# EAGLE design RoboTurkey (EAGLE 5.11)
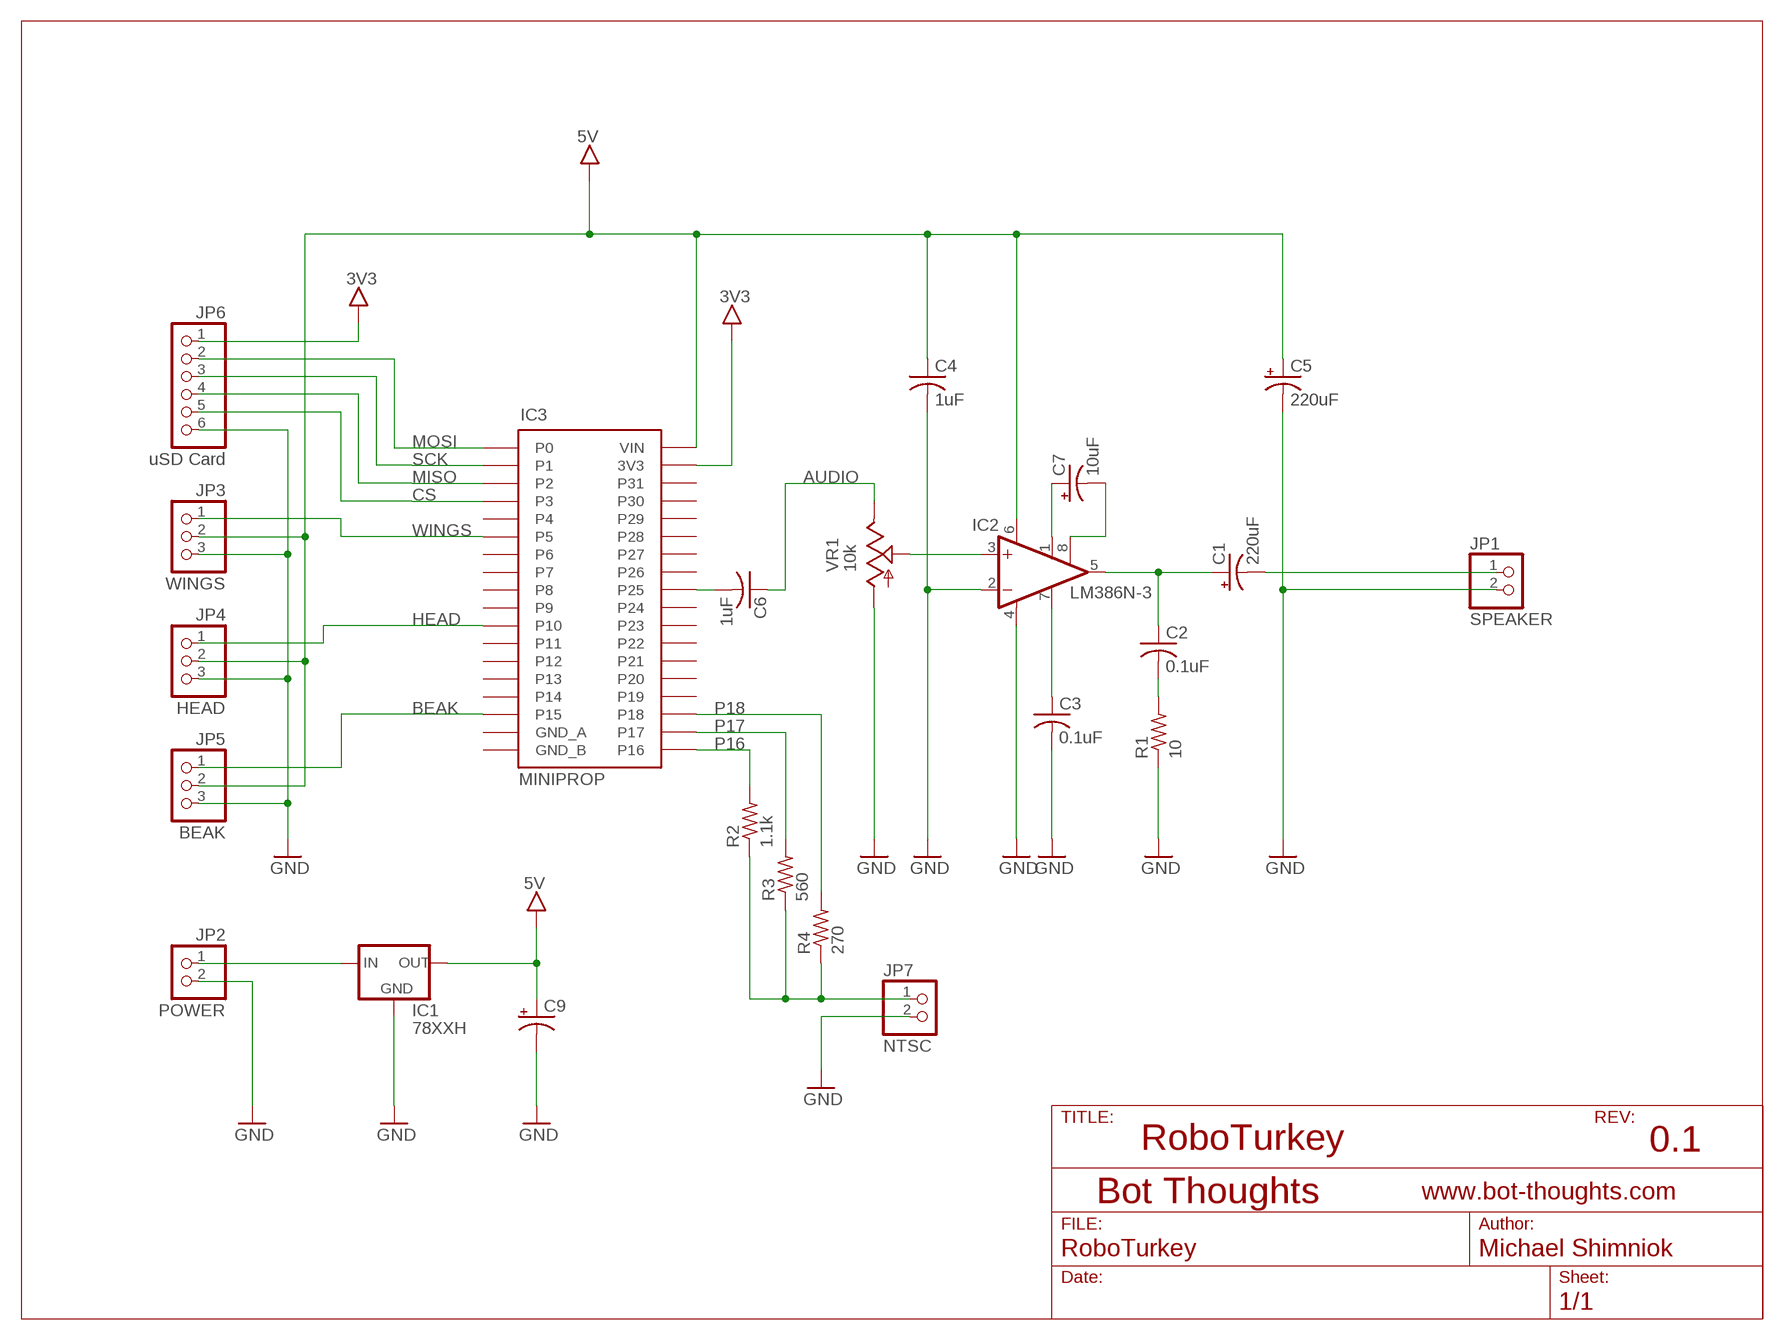
[diagram p0: schematic, sheet 1]

## Parts
C1  220uF  CPOL-USE2.5-6  [E2,5-6]
C2  0.1uF  C-US050-025X075  [C050-025X075]
C3  0.1uF  C-US050-025X075  [C050-025X075]
C4  1uF  C-US050-025X075  [C050-025X075]
C5  220uF  CPOL-USE2.5-6  [E2,5-6]
C6  1uF  C-US050-025X075  [C050-025X075]
C7  10uF  CPOL-USE2.5-6  [E2,5-6]
C9  CPOL-USE5-10.5  [E5-10,5]
IC1  78XXH  [TO220BH]
IC2  LM386N-3  [DIL08]
IC3  MINIPROP  [MINIPROP]
JP1  SPEAKER  PINHD-1X02_2.54-S  [1X02-S]
JP2  POWER  PINHD-1X02_2.54-S  [1X02-S]
JP3  WINGS  PINHD-1X03_2.54-S  [1X03-S]
JP4  HEAD  PINHD-1X03_2.54-S  [1X03-S]
JP5  BEAK  PINHD-1X03_2.54-S  [1X03-S]
JP6  uSD Card  PINHD-1X06_2.54-S  [1X06-S]
JP7  NTSC  PINHD-1X02_2.54-S  [1X02-S]
R1  10  R-US_0207/10  [0207/10]
R2  1.1k  R-US_0207/10  [0207/10]
R3  560  R-US_0207/10  [0207/10]
R4  270  R-US_0207/10  [0207/10]
VR1  10k  TRIM_US-CA6V  [CA6V]

## Nets
3V3: IC3.P$35(3V3) JP6.1
AUDIO: C6.1 VR1.E
BEAK: IC3.P$16(P15) JP5.1
CS: IC3.P$4(P3) JP6.5
GND: C3.2 C4.2 C5.- C9.- IC1.D(GND) IC2.2(-IN) IC2.4(GND) JP1.2 JP2.2 JP3.3 JP4.3 JP5.3 JP6.6 JP7.2 R1.1 VR1.A
HEAD: IC3.P$11(P10) JP4.1
MISO: IC3.P$3(P2) JP6.4
MOSI: IC3.P$1(P0) JP6.2
N$1: C2.2 R1.2
N$2: IC2.3(+IN) VR1.S
N$3: C1.+ C2.1 IC2.5(OUT)
N$5: IC1.G(IN) JP2.1
N$7: C1.- JP1.1
N$8: C6.2 IC3.P$28(P25)
N$9: C3.1 IC2.7(BYPASS)
N$10: C7.+ IC2.1(GAIN)
N$11: C7.- IC2.8(GAIN)
N$13: JP7.1 R2.1 R3.1 R4.1
P16: IC3.P$19(P16) R2.2
P17: IC3.P$20(P17) R3.2
P18: IC3.P$21(P18) R4.2
SCK: IC3.P$2(P1) JP6.3
VCC: C4.1 C5.+ C9.+ IC1.S(OUT) IC2.6(VS) IC3.P$36(VIN) JP3.2 JP4.2 JP5.2 ; supply symbol labelled 5V
WINGS: IC3.P$6(P5) JP3.1
Unconnected: IC3.P$5(P4) IC3.P$7(P6) IC3.P$8(P7) IC3.P$9(P8) IC3.P$10(P9) IC3.P$12(P11) IC3.P$13(P12) IC3.P$14(P13) IC3.P$15(P14) IC3.P$17(GND_A) IC3.P$18(GND_B) IC3.P$22(P19) IC3.P$23(P20) IC3.P$24(P21) IC3.P$25(P22) IC3.P$26(P23) IC3.P$27(P24) IC3.P$29(P26) IC3.P$30(P27) IC3.P$31(P28) IC3.P$32(P29) IC3.P$33(P30) IC3.P$34(P31)

## Notes on the sheet
- RoboTurkey | 0.1

## Library data of the parts
C1 C5 C7 C9 = rcl:CPOL-US: POLARIZED CAPACITOR, American symbol
C2-C4 C6 = rcl:C-US: CAPACITOR, American symbol
IC1 = ads4:78XX: Linear voltage regulator
IC2 = linear:LM386?-*: Low Voltage Audio Power Amplifier Source: http://cache.national.com/ds/LM/LM386.pdf
IC3 = mes_miniprop:MINIPROP: MiniProp: Parallax Propeller on 36-DIP form factor Board designed by Michael Shimniok Bot Thoughts Robotics Blog <http://www.bot-thoughts.com/>
JP1 JP2 JP7 = pinhead-2:PINHD-1X02: PIN HEADER
JP3-JP5 = pinhead-2:PINHD-1X03: PIN HEADER
JP6 = pinhead-2:PINHD-1X06: PIN HEADER
R1-R4 = rcl:R-US_: RESISTOR, American symbol
VR1 = pot:TRIM_US-: POTENTIOMETER

## Board
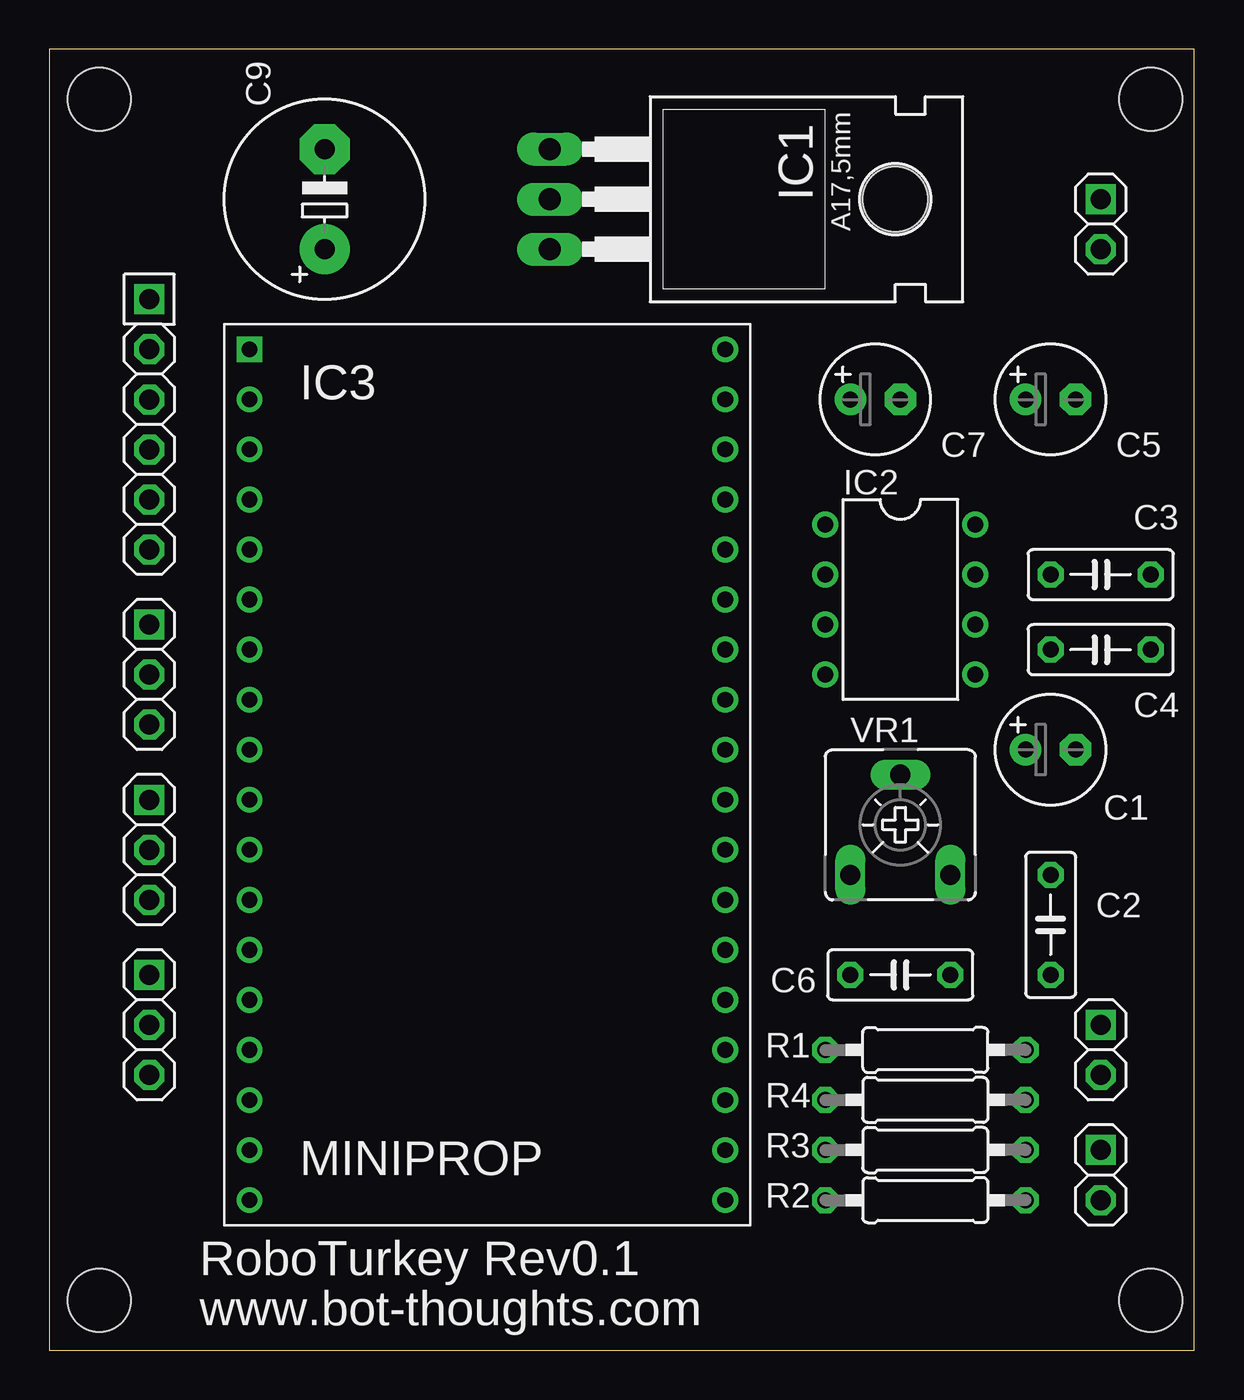
[diagram p1: board, top side]
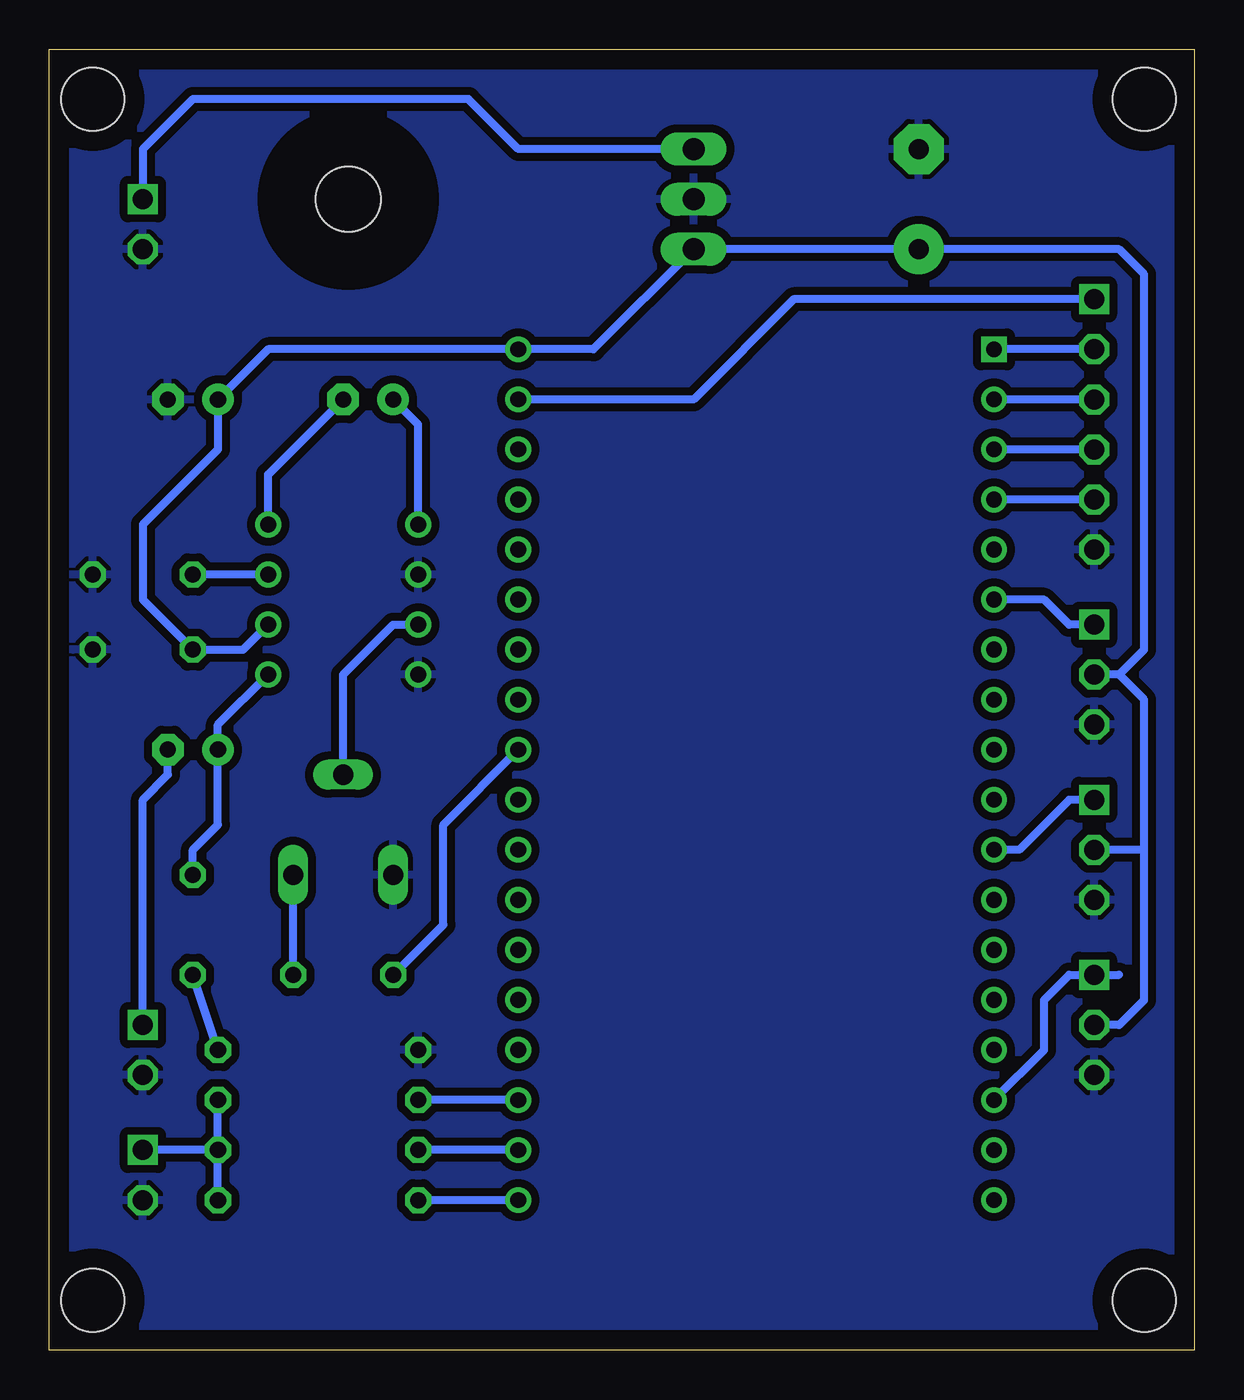
[diagram p2: board, bottom side, seen from below]

Size 58.09 x 66.03 mm. Coordinates in mm from the lower left corner, seen from the top.
Outline: 0,0 58.09,0 58.09,66.03 0,66.03 0,0
Copper layers (1*16): Top 0.035mm / dielectric 1.5mm / Bottom 0.035mm
Design rules "default": minimum track width 10mil, minimum drill 24mil, track to track 8mil, track to pad 8mil, pad to pad 8mil, via to via 8mil, smd to smd 8mil, copper to edge 40mil, drill to drill 8mil, minimum pad ring 10mil, minimum via ring 8mil, stop-mask expansion 4mil, vias tented up to drill 0mil, thermal gap 10mil
Holes 3.2 mm at 2.54,63.5 2.54,2.54 55.88,63.5 55.88,2.54

### Footprints (pad centres in the part's own frame; a part is rotated, then mirrored left to right if it is on the bottom)
E2,5-6 = drill 0.813 pad 1.6 round: + -1.27,0 | drill 0.813 pad 1.6 octagon: - 1.27,0
C050-025X075 = drill 0.813 octagon: 1 -2.54,0; 2 2.54,0
E5-10,5 = drill 1.016 pad 2.54 round: + -2.54,0 | drill 1.016 pad 2.54 octagon: - 2.54,0
TO220BH = drill 1.118 long: D 0,-6.35; G -2.54,-6.35; S 2.54,-6.35 | hole 3.302: 0,11.176
DIL08 = drill 0.813 pad 1.27 round: 1 -3.81,-3.81; 2 -1.27,-3.81; 3 1.27,-3.81; 4 3.81,-3.81; 5 3.81,3.81; 6 1.27,3.81; 7 -1.27,3.81; 8 -3.81,3.81
MINIPROP = drill 0.8 square: P$1 -11.43,21.59 | drill 0.8 round: P$2 -11.43,19.05; P$3 -11.43,16.51; P$4 -11.43,13.97; P$5 -11.43,11.43; P$6 -11.43,8.89; P$7 -11.43,6.35; P$8 -11.43,3.81; P$9 -11.43,1.27; P$10 -11.43,-1.27; P$11 -11.43,-3.81; P$12 -11.43,-6.35; P$13 -11.43,-8.89; P$14 -11.43,-11.43; P$15 -11.43,-13.97; P$16 -11.43,-16.51; P$17 -11.43,-19.05; P$18 -11.43,-21.59; P$19 12.7,-21.59; P$20 12.7,-19.05; P$21 12.7,-16.51; P$22 12.7,-13.97; P$23 12.7,-11.43; P$24 12.7,-8.89; P$25 12.7,-6.35; P$26 12.7,-3.81; P$27 12.7,-1.27; P$28 12.7,1.27; P$29 12.7,3.81; P$30 12.7,6.35; P$31 12.7,8.89; P$32 12.7,11.43; P$33 12.7,13.97; P$34 12.7,16.51; P$35 12.7,19.05; P$36 12.7,21.59
1X02-S = drill 1.016 square: 1 -1.27,0 | drill 1.016 octagon: 2 1.27,0
1X03-S = drill 1.016 square: 1 -2.54,0 | drill 1.016 octagon: 2 0,0; 3 2.54,0
1X06-S = drill 1.016 square: 1 -6.35,0 | drill 1.016 octagon: 2 -3.81,0; 3 -1.27,0; 4 1.27,0; 5 3.81,0; 6 6.35,0
0207/10 = drill 0.813 octagon: 1 -5.08,0; 2 5.08,0
CA6V = drill 1.016 long: A -2.54,-2.54; E 2.54,-2.54; S 0,2.54

### Placement (x,y rotation side)
C1  50.8,30.48 0 top
C2  50.8,21.59 270 top
C3  53.34,39.37 0 top
C4  53.34,35.56 0 top
C5  50.8,48.26 0 top
C6  43.18,19.05 180 top
C7  41.91,48.26 0 top
C9  13.97,58.42 90 top
IC1  31.75,58.42 270 top
IC2  43.18,38.1 270 top
IC3  21.59,29.21 0 top
JP1  53.34,15.24 270 top
JP2  53.34,57.15 270 top
JP3  5.08,34.29 270 top
JP4  5.08,25.4 270 top
JP5  5.08,16.51 270 top
JP6  5.08,46.99 270 top
JP7  53.34,8.89 270 top
R1  44.45,15.24 0 top
R2  44.45,7.62 180 top
R3  44.45,10.16 180 top
R4  44.45,12.7 180 top
VR1  43.18,26.67 0 top

### Tracks (layer width: path | path; a pad name or v marks a point on that pad's centre or on a via)
3V3
  Bottom 0.406: JP6.1 20.32,53.34 25.4,48.26 IC3.P$35
AUDIO
  Bottom 0.406: C6.1 VR1.E
BEAK
  Bottom 0.406: 3.81,19.05 JP5.1 6.35,19.05 7.62,17.78 7.62,15.24 IC3.P$16
CS
  Bottom 0.406: JP6.5 IC3.P$4
GND
  pour Bottom (isolate 0.406): 0,66.04 58.42,66.04 58.42,0 0,0
HEAD
  Bottom 0.406: JP4.1 6.35,27.94 8.89,25.4 IC3.P$11
MISO
  Bottom 0.406: JP6.4 IC3.P$3
MOSI
  Bottom 0.406: JP6.2 IC3.P$1
N$1
  Bottom 0.406: R1.2 C2.2
N$2
  Bottom 0.406: IC2.3 40.64,36.83 43.18,34.29 VR1.S
N$3
  Bottom 0.406: IC2.5 49.53,31.75 C1.+ 49.53,26.67 50.8,25.4 C2.1
N$5
  Bottom 0.406: IC1.G 34.29,60.96 36.83,63.5 50.8,63.5 53.34,60.96 JP2.1
N$7
  Bottom 0.406: C1.- 52.07,29.21 53.34,27.94 JP1.1
N$8
  Bottom 0.406: C6.2 38.1,21.59 38.1,26.67 IC3.P$28
N$9
  Bottom 0.406: IC2.7 C3.1
N$10
  Bottom 0.406: IC2.1 39.37,46.99 C7.+
N$11
  Bottom 0.406: IC2.8 46.99,44.45 C7.-
N$13
  Bottom 0.406: R3.1 R4.1 | R2.1 R3.1 | R3.1 JP7.1
P16
  Bottom 0.406: IC3.P$19 R2.2
P17
  Bottom 0.406: IC3.P$20 R3.2
P18
  Bottom 0.406: IC3.P$21 R4.2
SCK
  Bottom 0.406: JP6.3 IC3.P$2
VCC
  Bottom 0.406: JP5.2 3.81,16.51 2.54,17.78 2.54,25.4 | 2.54,25.4 JP4.2 | 3.81,34.29 JP3.2 | 3.81,34.29 2.54,33.02 2.54,25.4 | 3.81,34.29 2.54,35.56 2.54,53.34 2.54,54.61 3.81,55.88 C9.+ IC1.S 30.48,50.8 IC3.P$36 46.99,50.8 C5.+ 49.53,45.72 53.34,41.91 53.34,38.1 C4.1 48.26,35.56 IC2.6
WINGS
  Bottom 0.406: JP3.1 6.35,36.83 7.62,38.1 IC3.P$6

### Text on the board
tNames: RoboTurkey Rev0.1 | www.bot-thoughts.com